# EasyEDA schematic schematic-thermometer.json
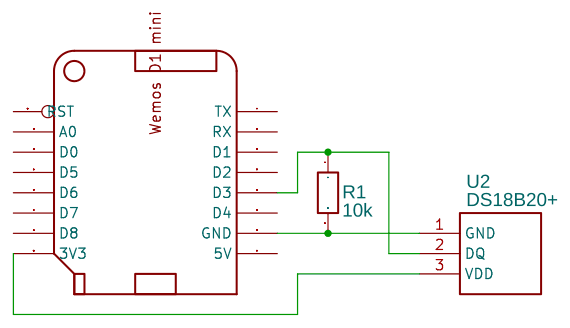
[diagram p0: schematic sheet]

## Parts
R1  10k  [AXIAL-0.3]
U1  WEMOS_D1_mini  [WEMOS_D1_MINI_SHOLE]
U2  DS18B20+  [TO-92(TO-92-3)]

## Library data of the parts
R1 = Res_AXIAL-0.3(1/8W)_EU
U1 = -: Manufacturer Part: WeMos D1 Mini Pro; Supplier Part: undefined; Contributor: MiniMax
U2 = -: Supplier: LCSC; Manufacturer: MAXIM; image: //image.lceda.cn/szlcsc/C9753.jpg; Supplier Part: C9753

## Nets
Net-(R1-1): R1.1 U1.D3 U2.2(DQ)
Net-(R1-2): R1.2 U1.GND U2.1(GND)
Net-(U1-3V3): U1.3V3 U2.3(VDD)

Not connected (* = marked no-connect by the designer): U1 5V A0 D0 D1 D2 D4 D5 D6 D7 D8 RST RX TX
